# Altium schematic sheet SWD.SchDoc
size A; SheetNumber: 4; SheetTotal: 9
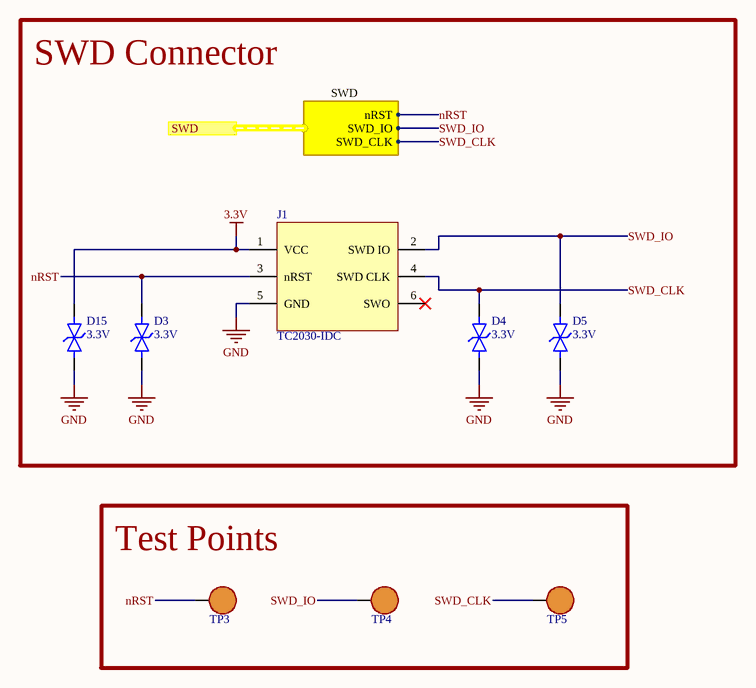
[diagram p0: SWD.SchDoc]

## Parts
D3  VRS: 3.3V  [0402-TVS]  (hidden comment: DESD3V3E1BL-7B)
D4  VRS: 3.3V  [0402-TVS]  (hidden comment: DESD3V3E1BL-7B)
D5  VRS: 3.3V  [0402-TVS]  (hidden comment: DESD3V3E1BL-7B)
D15  VRS: 3.3V  [0402-TVS]  (hidden comment: DESD3V3E1BL-7B)
J1  TC2030-IDC  [TAG CONNECT TC2030IDC - NO 3D MODEL]
TP3  RCWCTE  [RCWCTE]  (value not drawn)
TP4  RCWCTE  [RCWCTE]  (value not drawn)
TP5  RCWCTE  [RCWCTE]  (value not drawn)

## Blocks framed on the sheet
SWD Connector: D3-D5 D15 J1
Test Points: TP3-TP5

## Ports
SWD (harness SWD, see Christmas-2024_TSO-PCB_MASTER[2B], MCU[1C])

## Harnesses
SWD: SWD_CLK, SWD_IO, nRST

## Nets
3.3V: D15.1 J1.1(VCC)
GND: D3.2 D4.2 D5.2 D15.2 J1.5(GND)
nRST: D3.1 J1.3(nRST) TP3.1 ; port SWD.nRST
SWD_CLK: D4.1 J1.4(SWD_CLK) TP5.1 ; port SWD.SWD_CLK
SWD_IO: D5.1 J1.2(SWD_IO) TP4.1 ; port SWD.SWD_IO

Not connected (* = marked no-connect by the designer): J1 6(SWO)*

## Library data of the parts
D3-D5 D15 = TVS Diode 3.3V Bi: TVS DIODE 3.3VWM 7VC DFN1006-2; MFR: Diodes Incorporated; Type: SMD; VBR: 3.8V; VC: 7V; MFR PN: DESD3V3E1BL-7B
J1 = TC2030-IDC: "Plug of Nails" POGO Pin connector; MFR PN: TC2030-IDC-NL; MFR: Tag-Connect; Value: DNS
TP3-TP5 = TEST POINT: Test Point, Surface Mount; MFR: KOA Speer Electronics, Inc.; MFR PN: RCWCTE; Type: SMD